# Altium schematic sheet Sheet_1.schdoc
size 424 x 302 mm
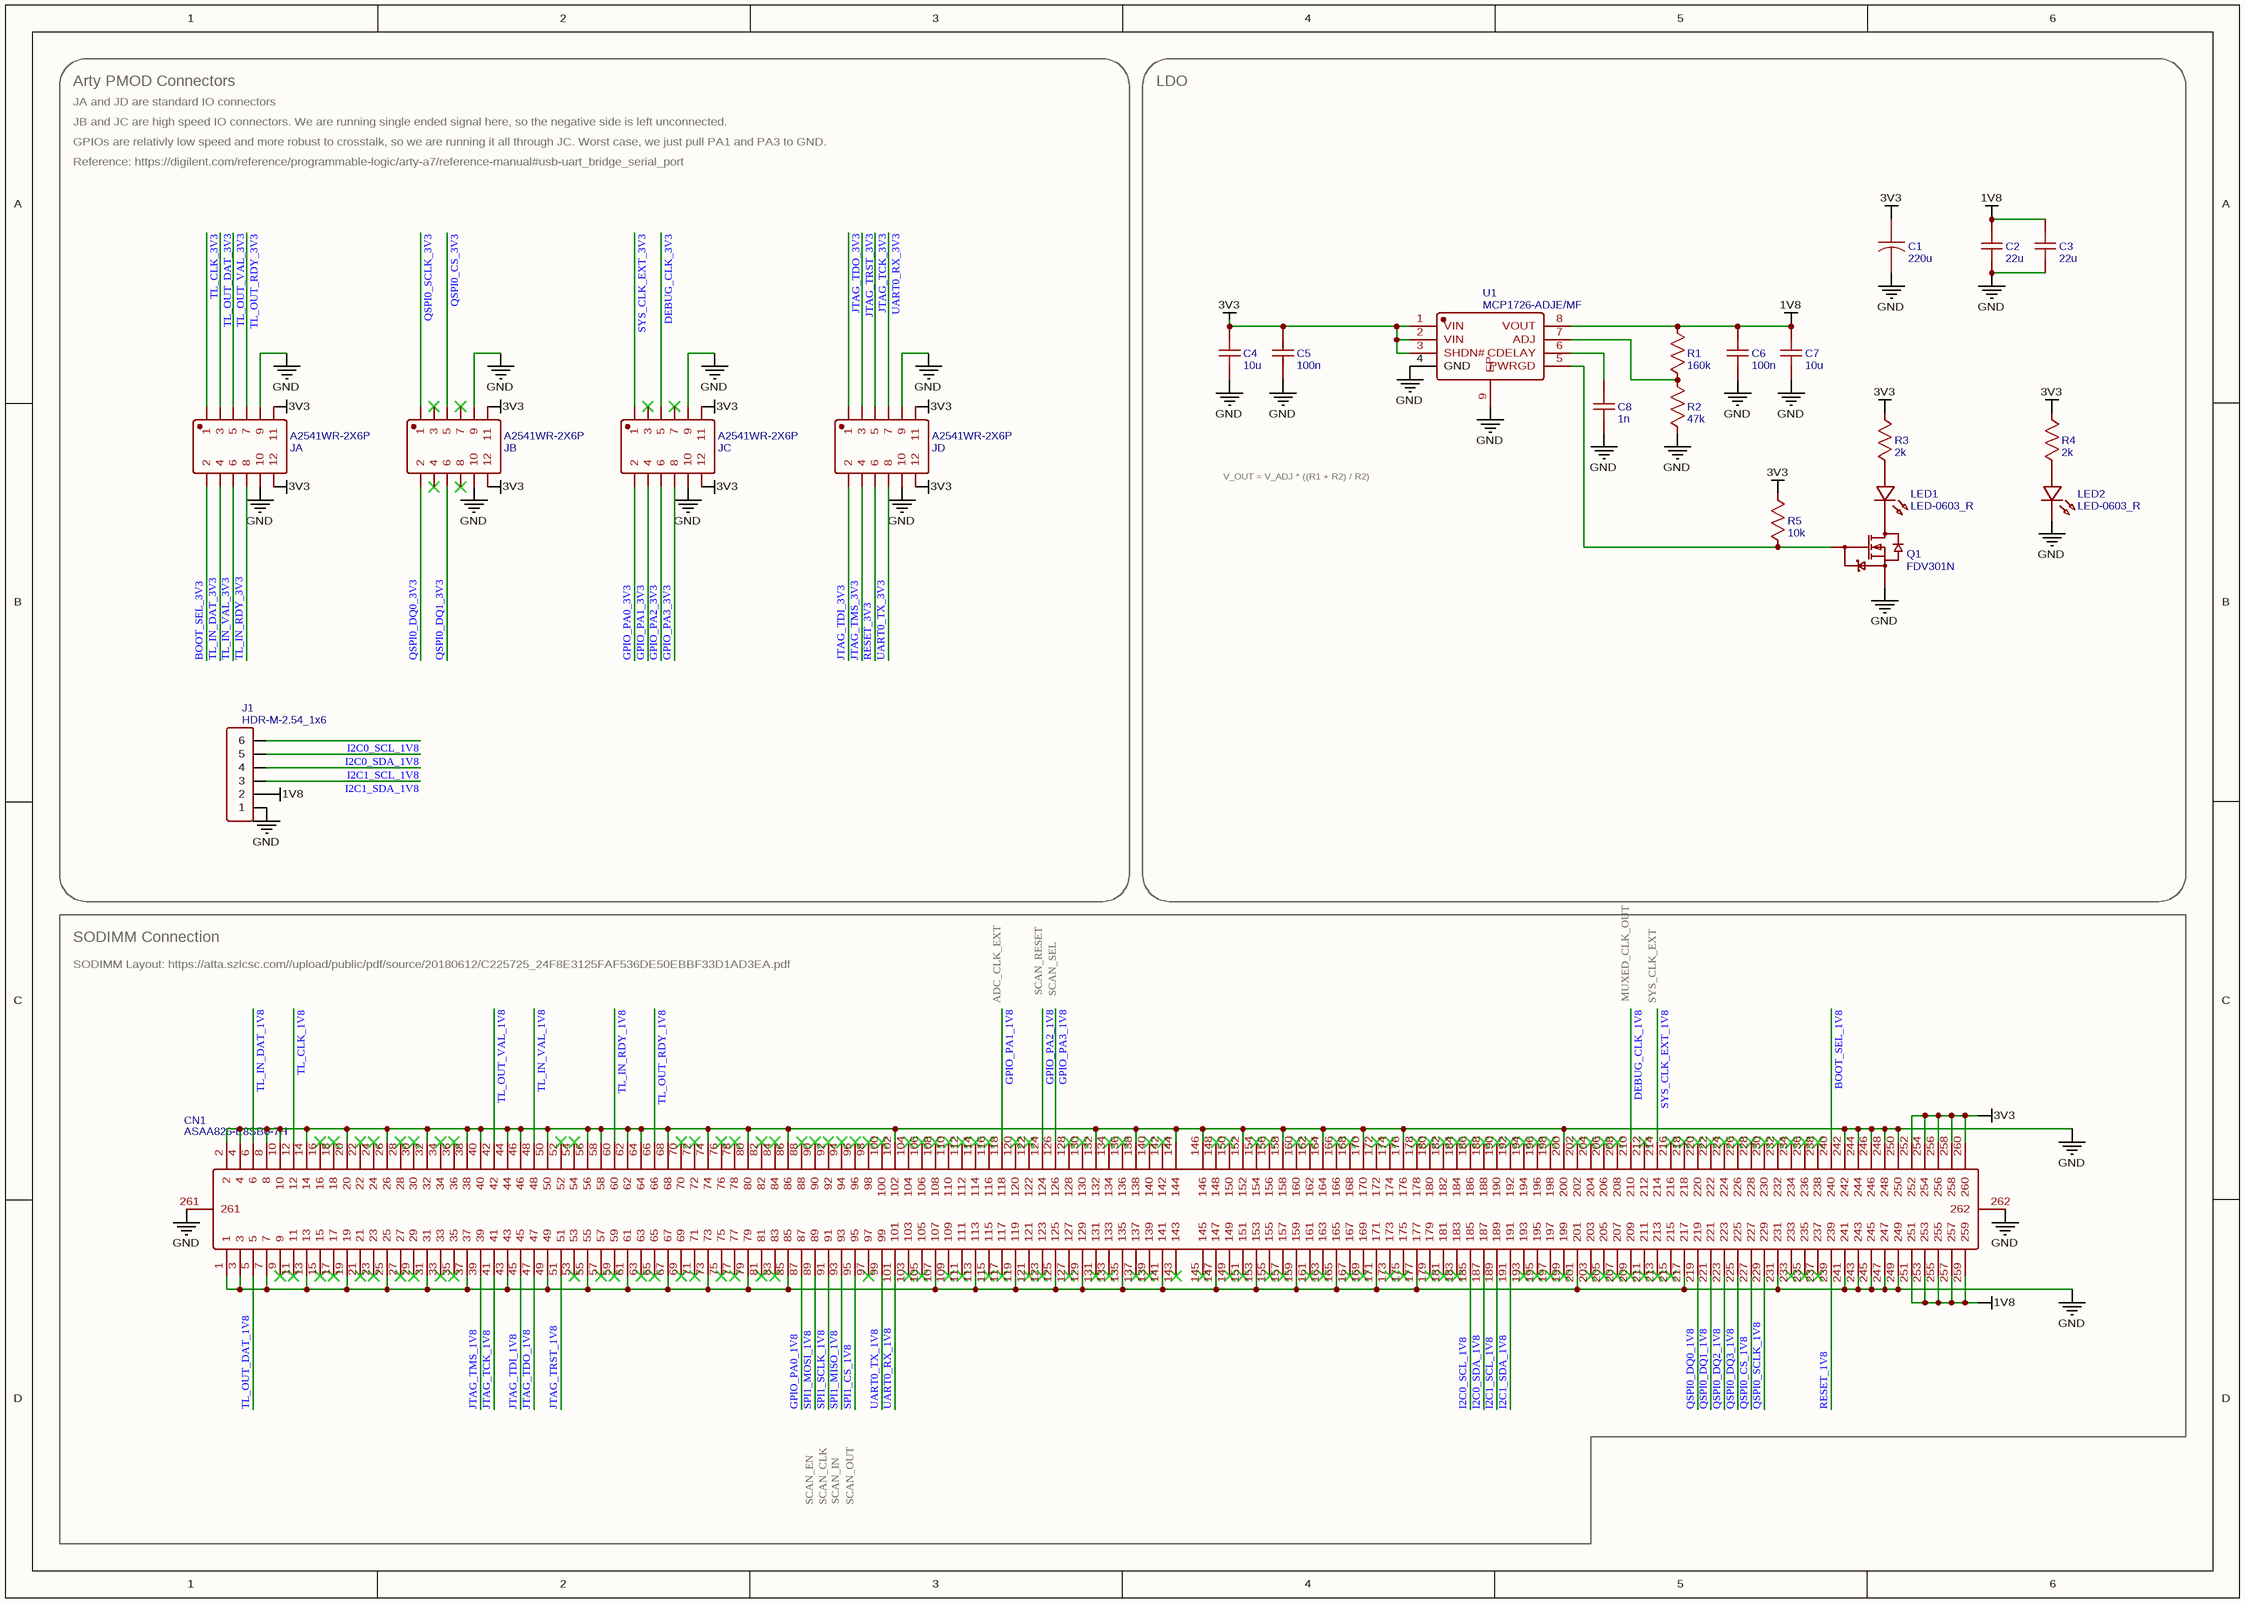
[diagram p0: Sheet_1.schdoc]

## Parts
C1  220u  [CAPPR5.0-D6.3_L6.6_W6.6]
C2  22u  [CAPA-1206]
C3  22u  [CAPA-1206]
C4  10u  [CAPA-0402]
C5  100n  [CAPA-0402]
C6  100n  [CAPA-0402]
C7  10u  [CAPA-0402]
C8  1n  [CAPA-0402]
CN1  ASAA826-E8SB0-7H  [CONN-SMD_ASAA826-E8SB0-7H]
J1  HDR-M-2.54_1x6  [HDR-M-2.54_1X6]
JA  A2541WR-2X6P  [CONN-TH_A2541WR-2X6P]
JB  A2541WR-2X6P  [CONN-TH_A2541WR-2X6P]
JC  A2541WR-2X6P  [CONN-TH_A2541WR-2X6P]
JD  A2541WR-2X6P  [CONN-TH_A2541WR-2X6P]
LED1  LED-0603_R  [LED-0603]
LED2  LED-0603_R  [LED-0603]
Q1  FDV301N  [SOT-23_L2.9-W1.3-P1.90-LS2.4-BR]
R1  160k  [RES-0402]
R2  47k  [RES-0402]
R3  2k  [RES-0402]
R4  2k  [RES-0402]
R5  10k  [RES-0402]
U1  MCP1726-ADJE/MF  [TDFN-8_L3.0-W3.0-P0.65-BL-EP]

## Blocks framed on the sheet
Arty PMOD Connectors: J1 JA JB JC JD
LDO: C1-C8 LED1 LED2 Q1 R1-R5 U1
SODIMM Connection: CN1

## Nets
1V8: C2.2 C3.2 C6.2 C7.2 CN1.251 CN1.253 CN1.255 CN1.257 CN1.259 J1.2 R1.2 U1.8(VOUT)
3V3: C1.1 C4.2 C5.2 CN1.252 CN1.254 CN1.256 CN1.258 CN1.260 JA.11 JA.12 JB.11 JB.12 JC.11 JC.12 JD.11 JD.12 R3.2 R4.2 R5.2 U1.1(VIN) U1.2(VIN) U1.3(SHDN#)
GND: C1.2 C2.1 C3.1 C4.1 C5.1 C6.1 C7.1 C8.1 CN1.1 CN1.2 CN1.3 CN1.4 CN1.7 CN1.8 CN1.10 CN1.13 CN1.14 CN1.19 CN1.20 CN1.25 CN1.26 CN1.31 CN1.32 CN1.37 CN1.38 CN1.40 CN1.43 CN1.44 CN1.46 CN1.49 CN1.50 CN1.55 CN1.56 CN1.58 CN1.61 CN1.62 CN1.64 CN1.67 CN1.68 CN1.73 CN1.74 CN1.79 CN1.80 CN1.85 CN1.86 CN1.102 CN1.107 CN1.113 CN1.119 CN1.125 CN1.129 CN1.132 CN1.135 CN1.138 CN1.141 CN1.144 CN1.146 CN1.147 CN1.152 CN1.153 CN1.158 CN1.159 CN1.164 CN1.165 CN1.170 CN1.171 CN1.176 CN1.177 CN1.200 CN1.201 CN1.217 CN1.231 CN1.241 CN1.242 CN1.243 CN1.244 CN1.245 CN1.246 CN1.247 CN1.248 CN1.249 CN1.250 CN1.261 CN1.262 J1.1 JA.9 JA.10 JB.9 JB.10 JC.9 JC.10 JD.9 JD.10 LED2.2 Q1.2(S) R2.1 U1.4(GND) U1.9(EP)
BOOT_SEL_1V8: CN1.240
BOOT_SEL_3V3: JA.2
DEBUG_CLK_1V8: CN1.210
DEBUG_CLK_3V3: JC.5
GPIO_PA0_1V8: CN1.87
GPIO_PA0_3V3: JC.2
GPIO_PA1_1V8: CN1.118
GPIO_PA1_3V3: JC.4
GPIO_PA2_1V8: CN1.124
GPIO_PA2_3V3: JC.6
GPIO_PA3_1V8: CN1.126
GPIO_PA3_3V3: JC.8
I2C0_SCL_1V8: CN1.185 J1.6
I2C0_SDA_1V8: CN1.187 J1.5
I2C1_SCL_1V8: CN1.189 J1.4
I2C1_SDA_1V8: CN1.191 J1.3
JTAG_TCK_1V8: CN1.41
JTAG_TCK_3V3: JD.5
JTAG_TDI_1V8: CN1.45
JTAG_TDI_3V3: JD.2
JTAG_TDO_1V8: CN1.47
JTAG_TDO_3V3: JD.1
JTAG_TMS_1V8: CN1.39
JTAG_TMS_3V3: JD.4
JTAG_TRST_1V8: CN1.51
JTAG_TRST_3V3: JD.3
QSPI0_CS_1V8: CN1.227
QSPI0_CS_3V3: JB.5
QSPI0_DQ0_1V8: CN1.219
QSPI0_DQ0_3V3: JB.2
QSPI0_DQ1_1V8: CN1.221
QSPI0_DQ1_3V3: JB.6
QSPI0_DQ2_1V8: CN1.223
QSPI0_DQ3_1V8: CN1.225
QSPI0_SCLK_1V8: CN1.229
QSPI0_SCLK_3V3: JB.1
RESET_1V8: CN1.239
RESET_3V3: JD.6
SPI1_CS_1V8: CN1.95
SPI1_MISO_1V8: CN1.93
SPI1_MOSI_1V8: CN1.89
SPI1_SCLK_1V8: CN1.91
SYS_CLK_EXT_1V8: CN1.214
SYS_CLK_EXT_3V3: JC.1
TL_CLK_1V8: CN1.12
TL_CLK_3V3: JA.1
TL_IN_DAT_1V8: CN1.6
TL_IN_DAT_3V3: JA.4
TL_IN_RDY_1V8: CN1.60
TL_IN_RDY_3V3: JA.8
TL_IN_VAL_1V8: CN1.48
TL_IN_VAL_3V3: JA.6
TL_OUT_DAT_1V8: CN1.5
TL_OUT_DAT_3V3: JA.3
TL_OUT_RDY_1V8: CN1.66
TL_OUT_RDY_3V3: JA.7
TL_OUT_VAL_1V8: CN1.42
TL_OUT_VAL_3V3: JA.5
UART0_RX_1V8: CN1.101
UART0_RX_3V3: JD.7
UART0_TX_1V8: CN1.99
UART0_TX_3V3: JD.8
NetC8_2: C8.2 U1.6(CDELAY)
NetLED1_1: LED1.1 R3.1
NetLED1_2: LED1.2 Q1.3(D)
NetLED2_1: LED2.1 R4.1
NetQ1_1: Q1.1(G) R5.1 U1.5(PWRGD)
NetR1_1: R1.1 R2.2 U1.7(ADJ)

Not connected (* = marked no-connect by the designer): CN1 9* 11* 15* 16* 17* 18* 21* 22* 23* 24* 27* 28* 29* 30* 33* 34* 35* 36* 52* 53* 54* 57* 59* 63* 65* 69* 70* 71* 72* 75* 76* 77* 78* 81* 82* 83* 84* 88* 90* 92* 94* 96* 97* 98* 100* 103* 104* 105* 106* 108* 109* 110* 111* 112* 114* 115* 116* 117* 120* 121* 122* 123* 127* 128* 130* 131* 133* 134* 136* 137* 139* 140* 142* 143* 145* 148* 149* 150* 151* 154* 155* 156* 157* 160* 161* 162* 163* 166* 167* 168* 169* 172* 173* 174* 175* 178* 179* 180* 181* 182* 183* 184* 186* 188* 190* 192* 193* 194* 195* 196* 197* 198* 199* 202* 203* 204* 205* 206* 207* 208* 209* 211* 212* 213* 215* 216* 218* 220* 222* 224* 226* 228* 230* 232* 233* 234* 235* 236* 237* 238*; JB 3* 4* 7* 8*; JC 3* 7*

## Notes on the sheet
- JA and JD are standard IO connectors
- JB and JC are high speed IO connectors. We are running single ended signal here, so the negative side is left unconnected.
- GPIOs are relativly low speed and more robust to crosstalk, so we are running it all through JC. Worst case, we just pull PA1 and PA3 to GND.
- Reference: https://digilent.com/reference/programmable-logic/arty-a7/reference-manual#usb-uart_bridge_serial_port
- V_OUT = V_ADJ * ((R1 + R2) / R2)
- SODIMM Layout: https://atta.szlcsc.com//upload/public/pdf/source/20180612/C225725_24F8E3125FAF536DE50EBBF33D1AD3EA.pdf
- ADC_CLK_EXT
- SCAN_RESET
- SCAN_SEL
- MUXED_CLK_OUT
- SYS_CLK_EXT
- SCAN_EN
- SCAN_CLK
- SCAN_IN
- SCAN_OUT

## Library data of the parts
C1 = 220u: BOM_Manufacturer Part: CK1A221M-CRE54; BOM_Manufacturer: SEMTECH 先科; nameAlias: Value(F); BOM_Supplier Part: C131157; BOM_Supplier: LCSC; link: https://atta.szlcsc.com//upload/public/pdf/source/20170919/C131157_1505787258263977000.pdf; spicePre: C; spiceSymbolName: CAPPR5.0-D6.3_220u_10V
C2 C3 = 22u: BOM_Manufacturer Part: CL31A226KAHNNNE; BOM_Manufacturer: SAMSUNG; nameAlias: Value(F); BOM_Supplier Part: C12891; BOM_Supplier: LCSC; link: https://atta.szlcsc.com/upload/public/pdf/source/20170325/1490427913016.pdf; spicePre: C; spiceSymbolName: CAPA-1206_22u_25V
C4 C7 = 10u: BOM_Manufacturer Part: JMK105CBJ106MV-F; BOM_Manufacturer: TAIYO YUDEN; nameAlias: Value(F); BOM_Supplier Part: C87148; BOM_Supplier: LCSC; link: https://atta.szlcsc.com//upload/public/pdf/source/20161110/1478747663421.pdf; spicePre: C; spiceSymbolName: CAPA-0402_10u
C5 C6 = 100n: BOM_Manufacturer Part: CL05B104KB54PNC; BOM_Manufacturer: SAMSUNG; nameAlias: Value(F); BOM_Supplier Part: C307331; BOM_Supplier: LCSC; link: https://atta.szlcsc.com//upload/public/pdf/source/20160103/1457707735223.pdf; spicePre: C; spiceSymbolName: CAPA-0402_100n
C8 = 1n: BOM_Manufacturer Part: CC0402JRNPO9BN102; BOM_Manufacturer: YAGEO 国巨; nameAlias: Value(F); BOM_Supplier Part: C113780; BOM_Supplier: LCSC; link: https://atta.szlcsc.com//upload/public/pdf/source/20170602/1496384427106.pdf; spicePre: C; spiceSymbolName: CAPA-0402_1n
CN1 = ASAA826-E8SB0-7H: BOM_Manufacturer: FOXCONN(富士康); BOM_Supplier: LCSC; BOM_Supplier Part: C2761395; BOM_Manufacturer Part: ASAA826-E8SB0-7H; BOM_JLCPCB Part Class: Extended Part; link: https://atta.szlcsc.com//upload/public/pdf/source/20210319/C2761395_2653904C6C1B88C6A2301D38F64E271B.pdf; spicePre: C; spiceSymbolName: ASAA826-E8SB0-7H
J1 = HDR-M-2.54_1x6: Contributor: LCEDA_Lib; BOM_Supplier Part: C190819; BOM_Supplier: LCSC; spicePre: J; spiceSymbolName: HDR-M-2.54_1x6
JA JB JC JD = A2541WR-2X6P: BOM_Manufacturer: CJT(长江连接器); BOM_Supplier: LCSC; BOM_Supplier Part: C239337; BOM_Manufacturer Part: A2541WR-2x6P; link: https://item.szlcsc.com/238441.html?ref=editor&logined=true; BOM_JLCPCB Part Class: Extended Part; spicePre: H; spiceSymbolName: A2541WR-2X6P
LED1 LED2 = LED-0603_R: BOM_Manufacturer: EVERLIGHT 台湾亿光; BOM_Manufacturer Part: 19-217/R6C-AL1M2VY/3T; Contributor: LCEDA_01; BOM_Supplier Part: C72044; BOM_Supplier: LCSC; link: https://atta.szlcsc.com//upload/public/pdf/source/20160507/1462613613821.pdf; spicePre: L; spiceSymbolName: LED-0603_R
Q1 = FDV301N: BOM_Manufacturer: onsemi(安森美); BOM_Supplier: LCSC; BOM_Manufacturer Part: FDV301N; BOM_Supplier Part: C15310; BOM_JLCPCB Part Class: Extended Part; spicePre: Q; spiceSymbolName: FDV301N
R1 = 160k: BOM_Manufacturer Part: 0402WGF1603TCE; BOM_Manufacturer: UniOhm 台湾厚声; nameAlias: Value(Ω); BOM_Supplier Part: C25757; BOM_Supplier: LCSC; link: https://atta.szlcsc.com//upload/public/pdf/source/20200306/C422600_1E6D84923E4A46A82E41ADD87F860B5C.pdf; spicePre: R; spiceSymbolName: RES-0402_160k
R2 = 47k: BOM_Manufacturer Part: 0402WGF4702TCE; BOM_Manufacturer: UniOhm 台湾厚声; nameAlias: Value(Ω); BOM_Supplier Part: C25792; BOM_Supplier: LCSC; link: https://atta.szlcsc.com//upload/public/pdf/source/20200306/C422600_1E6D84923E4A46A82E41ADD87F860B5C.pdf; spicePre: R; spiceSymbolName: RES-0402_47k
R3 R4 = 2k: BOM_Manufacturer Part: 0402WGF2001TCE; BOM_Manufacturer: UniOhm 台湾厚声; nameAlias: Value(Ω); BOM_Supplier Part: C4109; BOM_Supplier: LCSC; link: https://atta.szlcsc.com//upload/public/pdf/source/20200306/C422600_1E6D84923E4A46A82E41ADD87F860B5C.pdf; spicePre: R; spiceSymbolName: RES-0402_2k
R5 = 10k: BOM_Manufacturer Part: 0402WGF1002TCE; BOM_Manufacturer: UniOhm 台湾厚声; nameAlias: Value(Ω); BOM_Supplier Part: C25744; BOM_Supplier: LCSC; link: https://atta.szlcsc.com//upload/public/pdf/source/20200306/C422600_1E6D84923E4A46A82E41ADD87F860B5C.pdf; spicePre: R; spiceSymbolName: RES-0402_10k
U1 = MCP1726-ADJE/MF: BOM_Manufacturer: MICROCHIP(美国微芯); BOM_Supplier: LCSC; BOM_Supplier Part: C184287; BOM_Manufacturer Part: MCP1726-ADJE/MF; BOM_JLCPCB Part Class: Extended Part; link: https://ww1.microchip.com/downloads/aemDocuments/documents/APID/ProductDocuments/DataSheets/1A-Low-Voltage-Low-Quiescent-Current-LDO-Regulator-DS20001936E.pdf; spicePre: U; spiceSymbolName: MCP1726-ADJE/MF